# EAGLE board G80_a (EAGLE 8.2.2), part 1 of 2
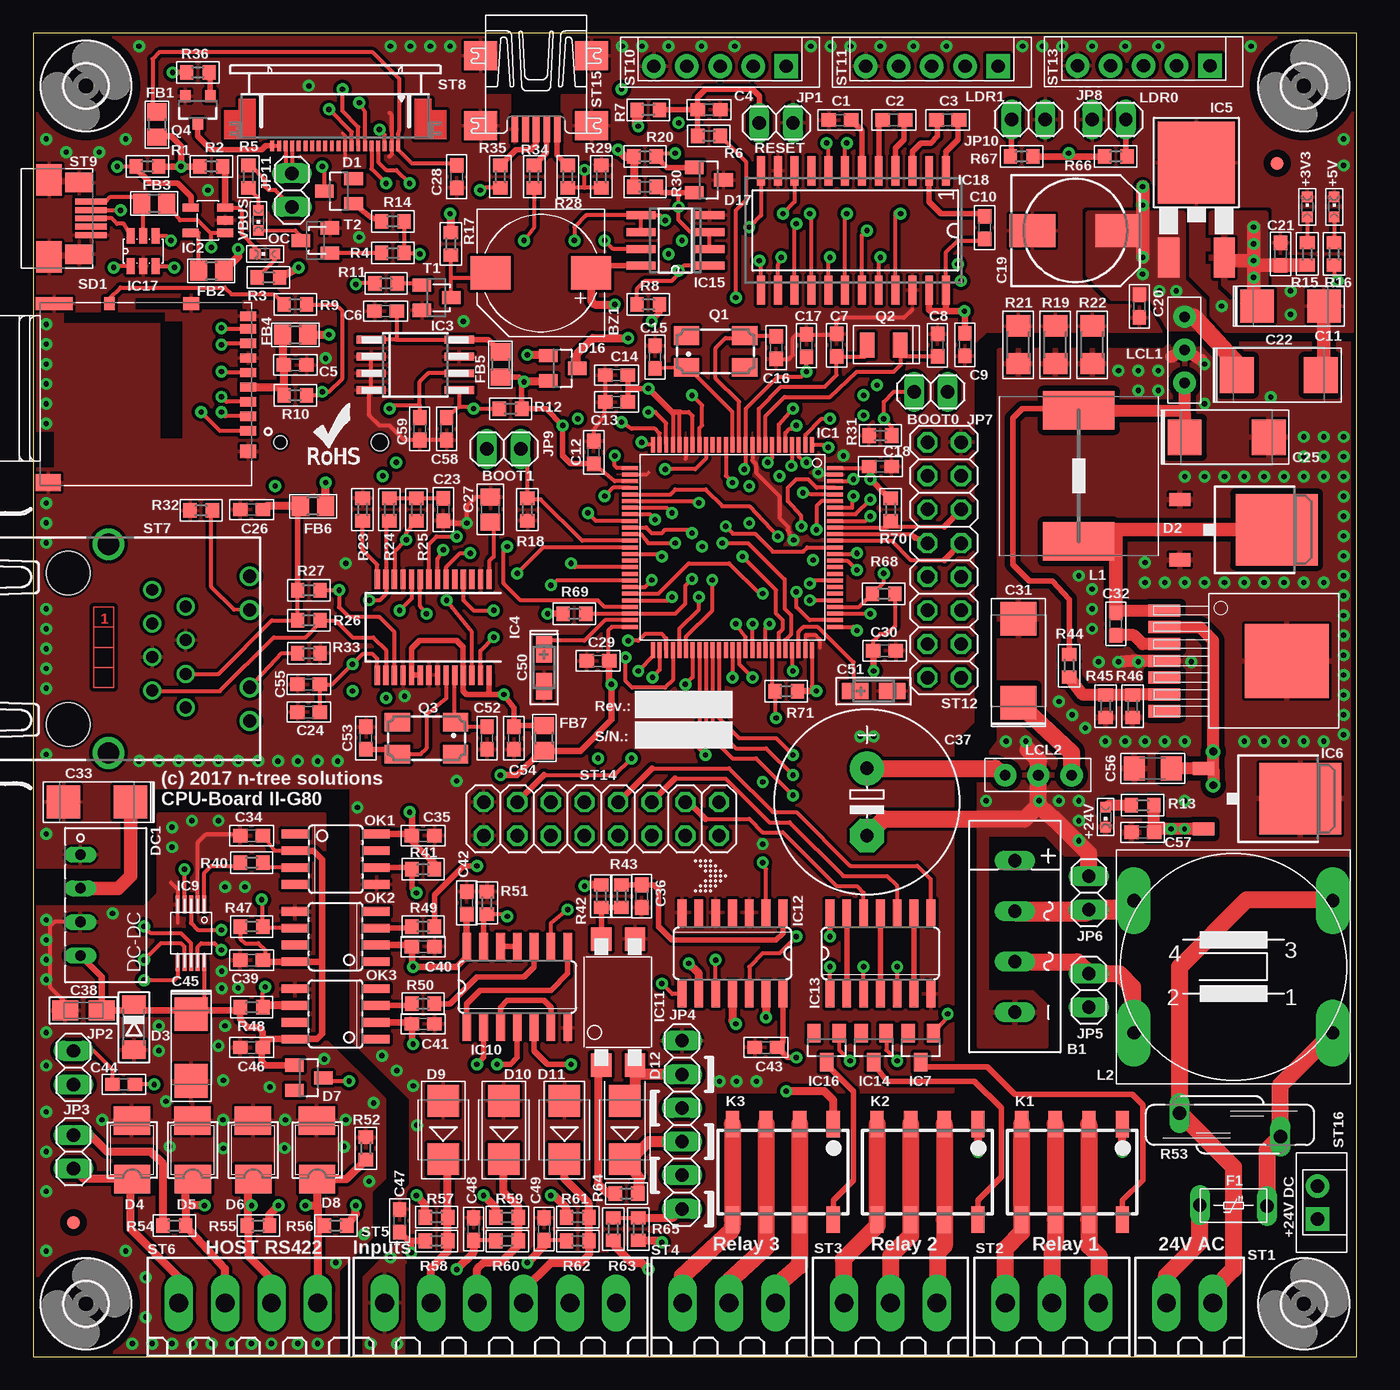
[diagram p10: board, top side]
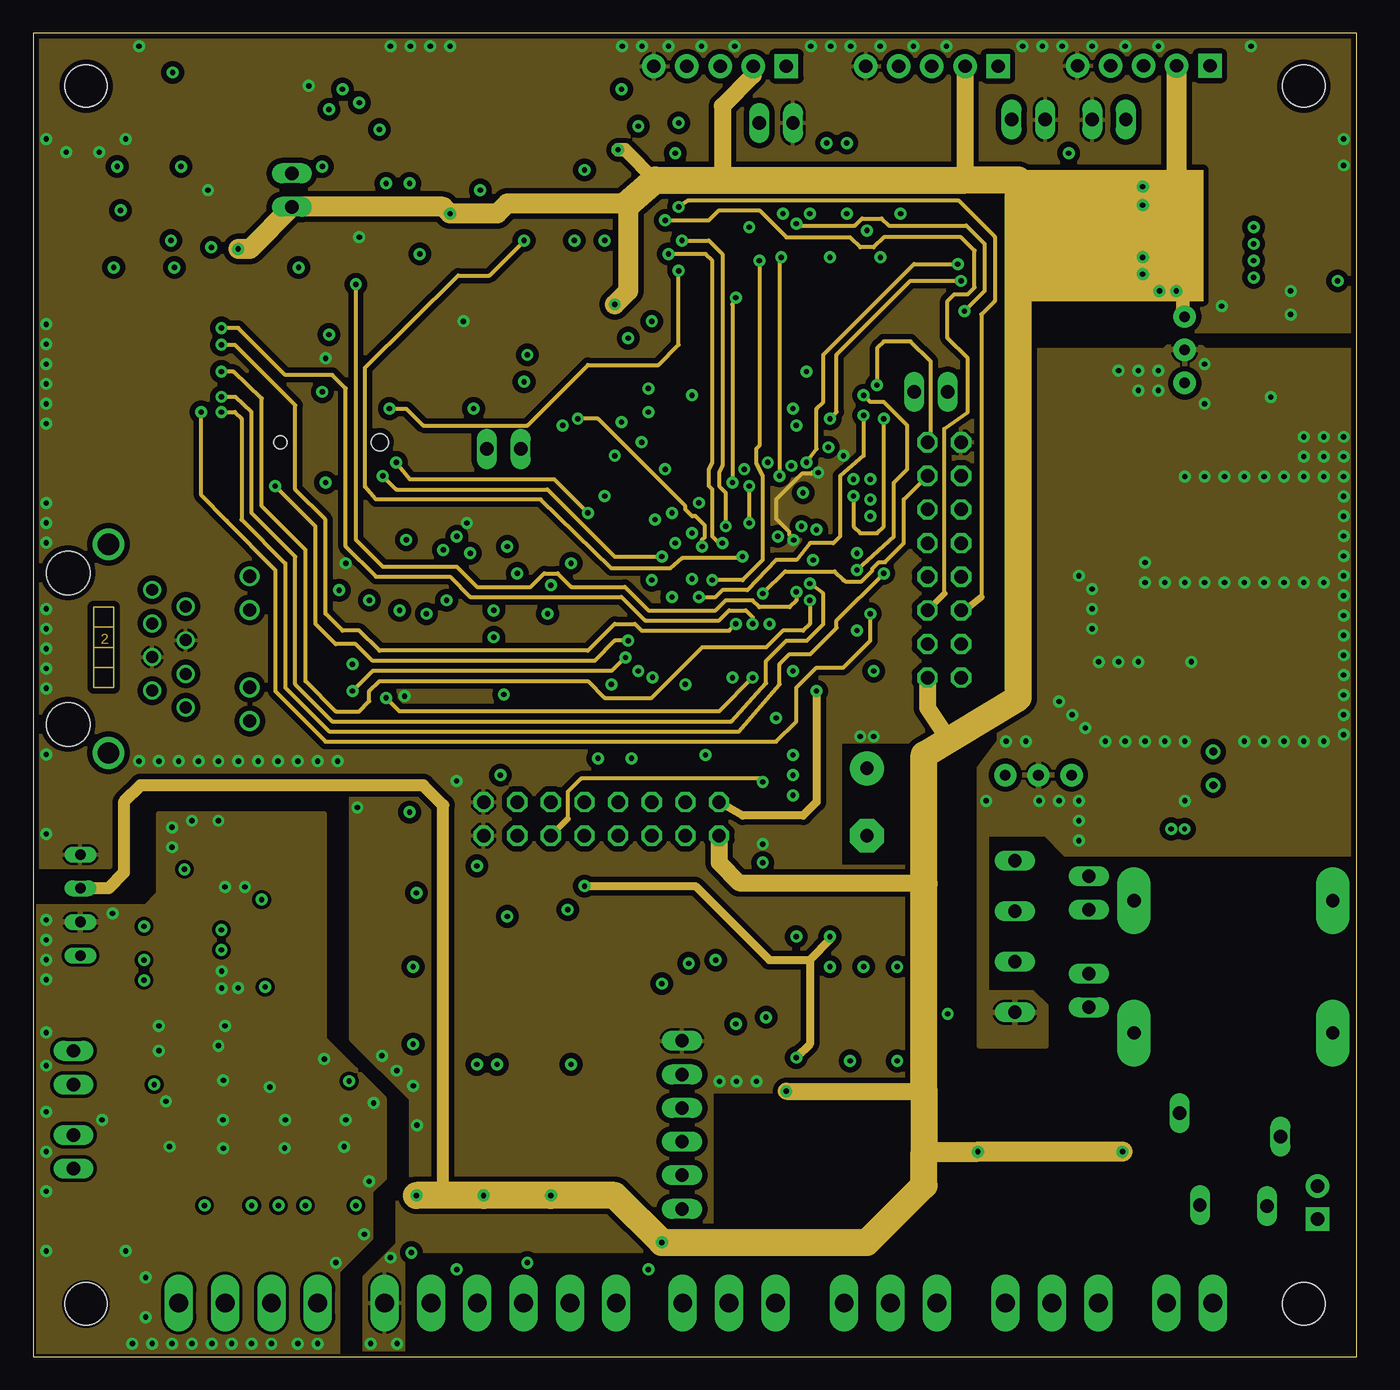
[diagram p11: board, inner layer IN1]
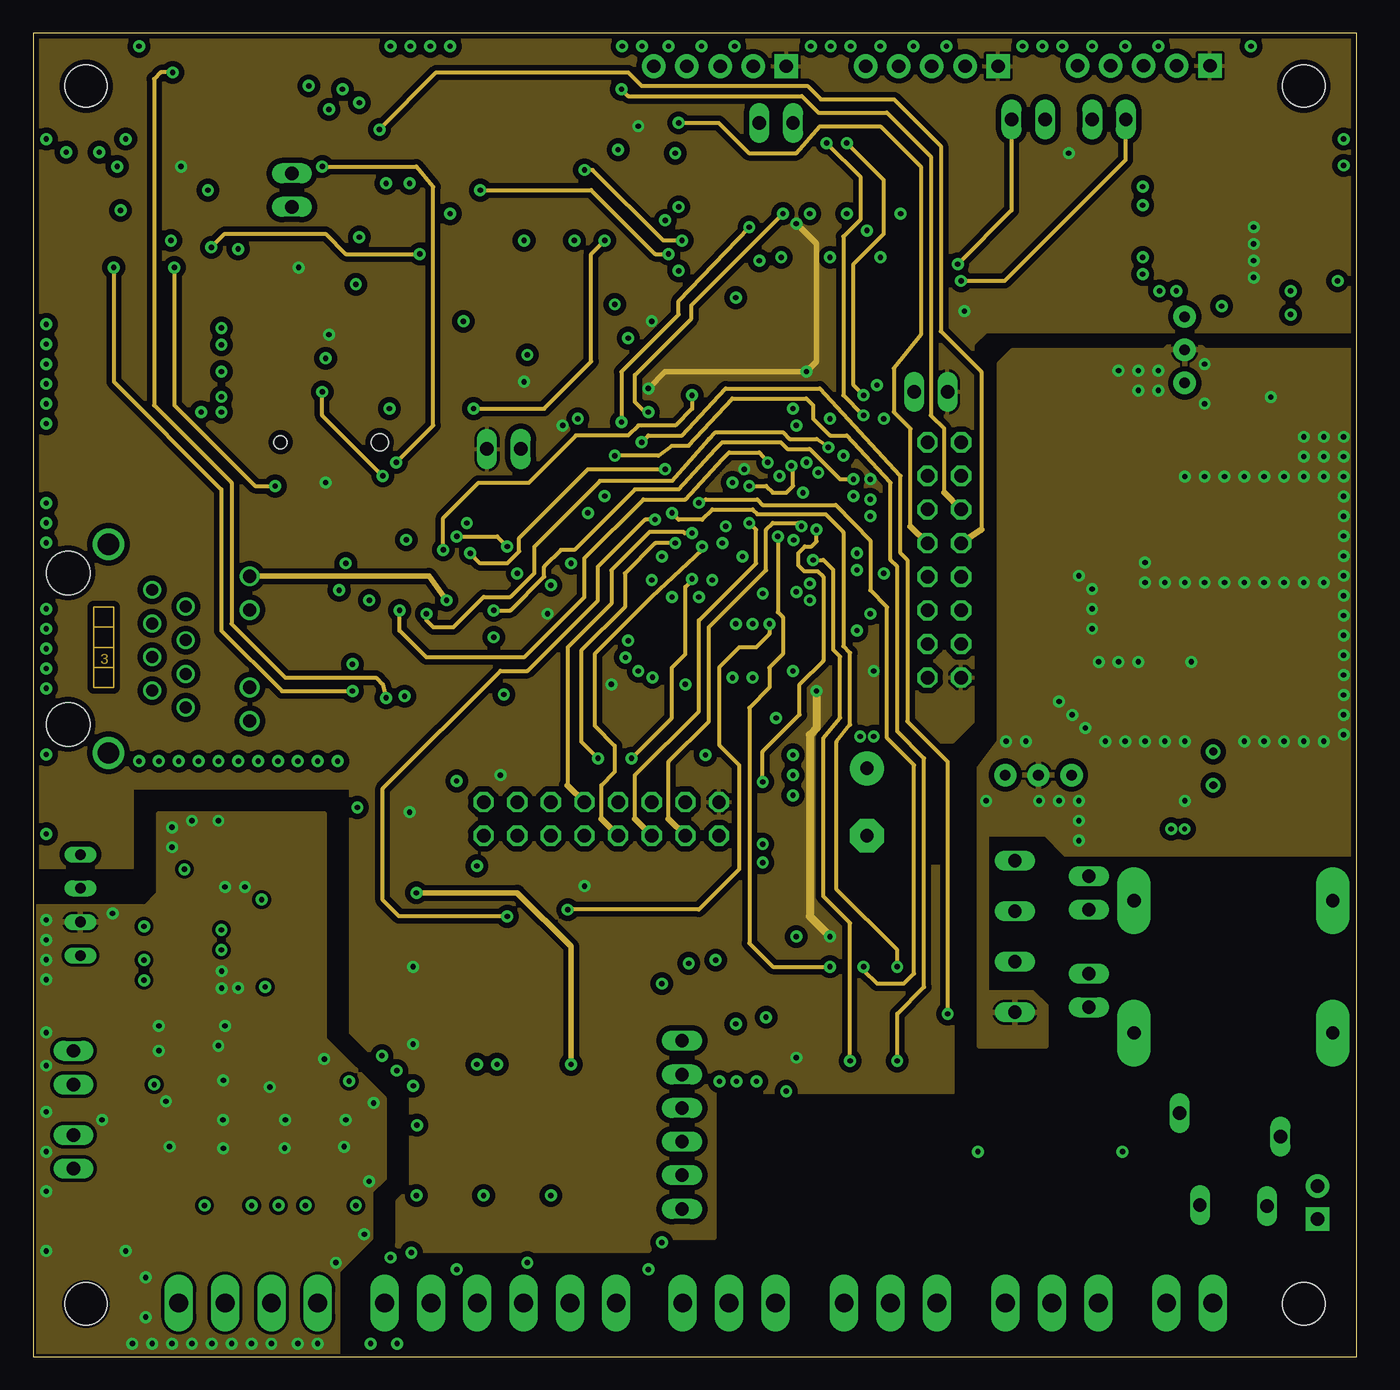
[diagram p12: board, inner layer +3V3]
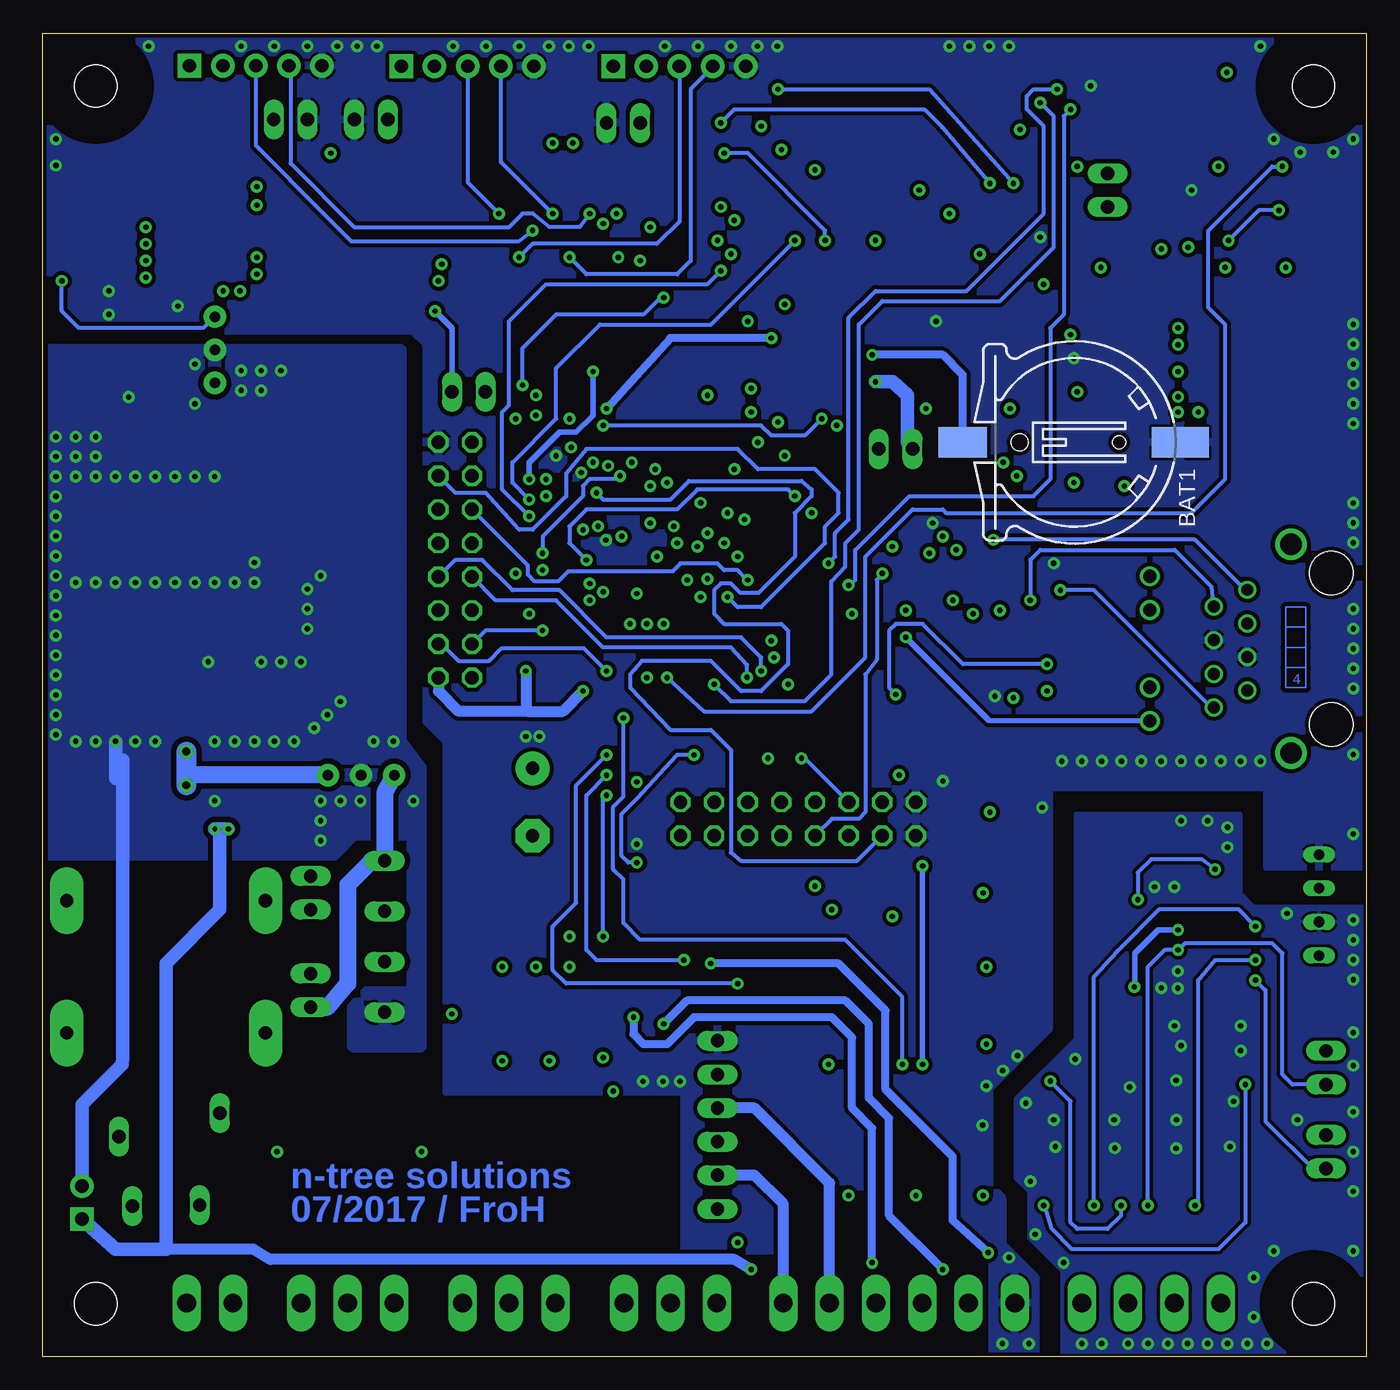
[diagram p13: board, bottom side, seen from below]

Size 100 x 100 mm. Coordinates in mm from the lower left corner, seen from the top.
Outline: 0,0 100,0 100,100 0,100 0,0
Copper layers ((1*2)+(15*16)): Top 0.018mm / dielectric 0.36mm / IN1 0.035mm / dielectric 0.71mm / +3V3 0.035mm / dielectric 0.2mm / Bottom 0.018mm
Design rules "Multi-CB_4L_125um-Tracks_OL35um-IL35um *": minimum track width 10mil, minimum drill 0.4mm, track to track 1mil, track to pad 1mil, pad to pad 1mil, via to via 1mil, smd to smd 0mil, copper to edge 0.2mm, drill to drill 0.2mm, minimum pad ring 0.125mm, minimum via ring 0.25mm, stop-mask expansion 2mil, vias tented up to drill 0.45mm, thermal gap 0.2mm
Net classes: 0 default: width 0.254 mm, drill 0.5 mm, clearance 0.254 mm; 1 0.5A: width 0.254 mm, drill 0.6 mm, clearance 0.254 mm; 2 24V AC Signal: width 1.524 mm, drill 0.6 mm, clearance 0.305 mm; 3 2A: width 1.016 mm, drill 0.6 mm, clearance 0.305 mm; 4 3A: width 1.524 mm, drill 0.6 mm, clearance 0.305 mm
bRestrict: area 103.1,69.3 to 110.5,79.5; area 103.6,61.5 to 111,68.1

## Footprints (pad centres in the part's own frame; a part is rotated, then mirrored left to right if it is on the bottom)
2KBP = drill 1.016 long: + 5.715,0; - -5.715,0; AC1 -1.905,0; AC2 1.905,0
CH291-1220LF = smd 2.3 x 3.66: + 0,-2.296 | smd 2.3 x 4.3: - 0,14.146 | hole 1.3: 0,2 | hole 1: 0,9.5
KTG0905CL = smd 2.5 x 3: P$1 0,3.8; P$2 0,-3.8
C0603 = smd 1.1 x 1: 1 -0.85,0; 2 0.85,0
C/6032-28R = smd 2.55 x 2.5: + 2.525,0; - -2.525,0
150CLZ-0810 = smd 3.5 x 2.5: + 3.25,0; - -3.25,0
D/7343-31R = smd 2.55 x 2.7: + 3.175,0; - -3.175,0
C0805 = smd 1.3 x 1.5: 1 -0.95,0; 2 0.95,0
E5-13 = drill 1.016 pad 2.54: + -2.54,0 | drill 1.016 pad 2.54 octagon: - 2.54,0
A/3216-18R = smd 1.95 x 1.5: + 1.375,0; - -1.375,0
CT3216 = smd 2 x 1.2: + -1.4,0; - 1.4,0
C1206 = smd 1.6 x 1.8: 1 -1.4,0; 2 1.4,0
SOT23 = smd 1 x 1.4: 1 -0.95,-1.1; 2 0.95,-1.1; 3 0,1.1
DPACK_3 = smd 1 x 1.6: 1 -2.28,-4.8; 3 2.28,-4.8 | smd 5.4 x 6.2: 4 0,2.5
SOD80C = smd 1.4 x 1.8: A 1.7,0; C -1.7,0
SMB = smd 2.159 x 2.743: 1 -2.311,-0.127; 2 2.108,-0.102
SMB' = smd 2.4 x 2.4: A 2.2,0; C -2.2,0
NME = drill 0.8 long: 1 0,3.81; 2 0,1.27; 3 0,-1.27; 4 0,-3.81
RXEF025-2 = drill 1 long: IN -2.54,0.04; OUT 2.54,-0.04
R805 = smd 1.3 x 1.5: 1 -0.95,0; 2 0.95,0
FIDUCIAL-1X2 = smd 1 x 1: 1 0,0
LQFP100 = smd 0.3 x 1.2: 1 -6,-7.75; 2 -5.5,-7.75; 3 -5,-7.75; 4 -4.5,-7.75; 5 -4,-7.75; 6 -3.5,-7.75; 7 -3,-7.75; 8 -2.5,-7.75; 9 -2,-7.75; 10 -1.5,-7.75; 11 -1,-7.75; 12 -0.5,-7.75; 13 0,-7.75; 14 0.5,-7.75; 15 1,-7.75; 16 1.5,-7.75; 17 2,-7.75; 18 2.5,-7.75; 19 3,-7.75; 20 3.5,-7.75; 21 4,-7.75; 22 4.5,-7.75; 23 5,-7.75; 24 5.5,-7.75; 25 6,-7.75; 51 6,7.75; 52 5.5,7.75; 53 5,7.75; 54 4.5,7.75; 55 4,7.75; 56 3.5,7.75; 57 3,7.75; 58 2.5,7.75; 59 2,7.75; 60 1.5,7.75; 61 1,7.75; 62 0.5,7.75; 63 0,7.75; 64 -0.5,7.75; 65 -1,7.75; 66 -1.5,7.75; 67 -2,7.75; 68 -2.5,7.75; 69 -3,7.75; 70 -3.5,7.75; 71 -4,7.75; 72 -4.5,7.75; 73 -5,7.75; 74 -5.5,7.75; 75 -6,7.75 | smd 1.2 x 0.3: 26 7.75,-6; 27 7.75,-5.5; 28 7.75,-5; 29 7.75,-4.5; 30 7.75,-4; 31 7.75,-3.5; 32 7.75,-3; 33 7.75,-2.5; 34 7.75,-2; 35 7.75,-1.5; 36 7.75,-1; 37 7.75,-0.5; 38 7.75,0; 39 7.75,0.5; 40 7.75,1; 41 7.75,1.5; 42 7.75,2; 43 7.75,2.5; 44 7.75,3; 45 7.75,3.5; 46 7.75,4; 47 7.75,4.5; 48 7.75,5; 49 7.75,5.5; 50 7.75,6; 76 -7.75,6; 77 -7.75,5.5; 78 -7.75,5; 79 -7.75,4.5; 80 -7.75,4; 81 -7.75,3.5; 82 -7.75,3; 83 -7.75,2.5; 84 -7.75,2; 85 -7.75,1.5; 86 -7.75,1; 87 -7.75,0.5; 88 -7.75,0; 89 -7.75,-0.5; 90 -7.75,-1; 91 -7.75,-1.5; 92 -7.75,-2; 93 -7.75,-2.5; 94 -7.75,-3; 95 -7.75,-3.5; 96 -7.75,-4; 97 -7.75,-4.5; 98 -7.75,-5; 99 -7.75,-5.5; 100 -7.75,-6
SOT23-5 = smd 0.62 x 1.22: 1 -0.95,-1.31; 2 0,-1.31; 3 0.95,-1.31; 4 0.95,1.31; 5 -0.95,1.31
SO-08M = smd 0.6 x 2.2: 1 -1.905,-3.33; 2 -0.635,-3.33; 3 0.635,-3.33; 4 1.905,-3.33; 5 1.905,3.33; 6 0.635,3.33; 7 -0.635,3.33; 8 -1.905,3.33
SSOP28 = smd 0.4 x 1.5: 1 -4.225,-3.625; 2 -3.575,-3.625; 3 -2.925,-3.625; 4 -2.275,-3.625; 5 -1.625,-3.625; 6 -0.975,-3.625; 7 -0.325,-3.625; 8 0.325,-3.625; 9 0.975,-3.625; 10 1.625,-3.625; 11 2.275,-3.625; 12 2.925,-3.625; 13 3.575,-3.625; 14 4.225,-3.625; 15 4.225,3.625; 16 3.575,3.625; 17 2.925,3.625; 18 2.275,3.625; 19 1.625,3.625; 20 0.975,3.625; 21 0.325,3.625; 22 -0.325,3.625; 23 -0.975,3.625; 24 -1.625,3.625; 25 -2.275,3.625; 26 -2.925,3.625; 27 -3.575,3.625; 28 -4.225,3.625
D-PAK = smd 6.2 x 5.8: 1 -3.1,0 | smd 3 x 1.6: 2 4.08,2.1; 3 4.08,-2.1
TO252 = smd 1 x 1.6: 1 -2.28,-4.8; 2 2.28,-4.8 | smd 5.4 x 6.2: 3 0,2.5
TO263-7 = smd 0.91 x 2.41: 1 -3.81,-8.255; 2 -2.54,-8.255; 3 -1.27,-8.255; 4 0,-8.255; 5 1.27,-8.255; 6 2.54,-8.255; 7 3.81,-8.255 | smd 5.59 x 6.35: 8 0,0.985
TI_SN65HVD3080E = smd 0.3 x 1.33: 1 -1,-2.175; 2 -0.5,-2.175; 3 0,-2.175; 4 0.5,-2.175; 5 1,-2.175; 6 1,2.175; 7 0.5,2.175; 8 0,2.175; 9 -0.5,2.175; 10 -1,2.175
SO14 = smd 0.66 x 2.032: 1 -3.81,-3.073; 2 -2.54,-3.073; 3 -1.27,-3.073; 4 0,-3.073; 5 1.27,-3.073; 6 2.54,-3.073; 7 3.81,-3.073; 8 3.81,3.073; 9 2.54,3.073; 10 1.27,3.073; 11 0,3.073; 12 -1.27,3.073; 13 -2.54,3.073; 14 -3.81,3.073
SO-6/4 = smd 1.524 x 1.778: 1 1.27,4.763; 2 -1.27,4.763; 3 -1.27,-4.763; 4 1.27,-4.763
SO08 = smd 0.6 x 2.2: 1 -1.905,-2.6; 2 -0.635,-2.6; 3 0.635,-2.6; 4 1.905,-2.6; 5 1.905,2.6; 6 0.635,2.6; 7 -0.635,2.6; 8 -1.905,2.6
SO23-6L = smd 0.6 x 1.2: 1 0,0; 2 0.95,0; 3 1.9,0; 4 1.9,2.3; 5 0.95,2.3; 6 0,2.3
SSOP24 = smd 0.6 x 2.2: 1 -6.985,-4.5; 2 -5.715,-4.5; 3 -4.445,-4.5; 4 -3.175,-4.5; 5 -1.905,-4.5; 6 -0.635,-4.5; 7 0.635,-4.5; 8 1.905,-4.5; 9 3.175,-4.5; 10 4.445,-4.5; 11 5.715,-4.5; 12 6.985,-4.5; 13 6.985,4.5; 14 5.715,4.5; 15 4.445,4.5; 16 3.175,4.5; 17 1.905,4.5; 18 0.635,4.5; 19 -0.635,4.5; 20 -1.905,4.5; 21 -3.175,4.5; 22 -4.445,4.5; 23 -5.715,4.5; 24 -6.985,4.5
1X02 = drill 1.016 long: 1 -1.27,0; 2 1.27,0
1X06 = drill 1.016 long: 1 -6.35,0; 2 -3.81,0; 3 -1.27,0; 4 1.27,0; 5 3.81,0; 6 6.35,0
G6K-2F = smd 1 x 2: 1 -3.81,-3.6; 2 -1.27,-3.6; 3 1.27,-3.6; 4 3.81,-3.6; 5 3.81,3.6; 6 1.27,3.6; 7 -1.27,3.6; 8 -3.81,3.6
WE-PD_L/XL/XXL = smd 2.9 x 5.4: 1 -4.95,0; 2 4.95,0
RN112 = drill 1 pad 2.54 long: 1 -7.506,4.999; 2 7.506,4.999; 3 -7.506,-4.999; 4 7.506,-4.999
T-FILTERSIL = drill 0.8 pad 1.676: 1 -2.502,0; 2 0,0; 3 2.502,0
CHIPLED_0603 = smd 0.8 x 0.8: A 0,-0.75; C 0,0.75
SOIC08 = smd 0.66 x 2.032: 1 -1.905,-3.073; 2 -0.635,-3.073; 3 0.635,-3.073; 4 1.905,-3.073; 5 1.905,3.073; 6 0.635,3.073; 7 -0.635,3.073; 8 -1.905,3.073
CTS406 = smd 1.9 x 1.4: 1 -2.2,-1.2; 2 2.2,-1.2; 3 2.2,1.2; 4 -2.2,1.2
3.2X1.5-2-PAD = smd 1.1 x 1.9: 1 -1.25,0; 2 1.25,0
SOT23-3 = smd 0.8 x 0.9: 1 -0.95,-1; 2 0.95,-1; 3 0,1.1
R0603 = smd 1 x 1.1: 1 -0.85,0; 2 0.85,0
R1206 = smd 1.6 x 1.803: 1 -1.422,0; 2 1.422,0
S10K17 = drill 1.016 long: 1 -0.889,-3.81; 2 0.889,3.81
HRS_DM3AT-SF-PEJM5 = smd 0.7 x 1.2: 1 3.2,0; 2 2.1,0; 3 1,0; 4 -0.1,0; 5 -1.2,0; 6 -2.3,0; 7 -3.4,0; 8 -4.5,0; SWB -5.45,0 | smd 1 x 1.2: P1 -6.4,-4.3; P4 4.75,0 | smd 1 x 2.8: P2 -6.4,-14.65 | smd 1.3 x 1.9: P3 7.1,-15.1 | smd 1 x 0.8: SWA -6.4,-10.5
180G-2 = drill 1.422 long: 1 -1.75,0; 2 1.75,0
180G-3 = drill 1.422 long: 1 -3.5,0; 2 0,0; 3 3.5,0
180G-6 = drill 1.422 long: 1 -8.75,0; 2 -5.25,0; 3 -1.75,0; 4 1.75,0; 5 5.25,0; 6 8.75,0
180G-4 = drill 1.422 long: 1 -5.25,0; 2 -1.75,0; 3 1.75,0; 4 5.25,0
J1 = drill 0.9 pad 1.3: 1 4.445,2.54; 2 3.175,0; 3 1.905,2.54; 4 0.635,0; 5 -0.635,2.54; 6 -1.905,0; 7 -3.175,2.54; 8 -4.445,0 | drill 1 pad 1.422: 9 5.465,7.37; 10 2.925,7.37; 11 -2.925,7.37; 12 -5.465,7.37 | drill 1.6 pad 2.184: M1 -7.875,-3.3; M2 7.875,-3.3 | hole 3.3: 5.715,-6.35; -5.715,-6.35
52745-2090 = smd 0.3 x 0.8: 1 -4.75,2.5; 2 -4.25,2.5; 3 -3.75,2.5; 4 -3.25,2.5; 5 -2.75,2.5; 6 -2.25,2.5; 7 -1.75,2.5; 8 -1.25,2.5; 9 -0.75,2.5; 10 -0.25,2.5; 11 0.25,2.5; 12 0.75,2.5; 13 1.25,2.5; 14 1.75,2.5; 15 2.25,2.5; 16 2.75,2.5; 17 3.25,2.5; 18 3.75,2.5; 19 4.25,2.5; 20 4.75,2.5
MOLEX_47346-0001 = smd 0.45 x 2.388: 1 -1.27,0.508; 2 -0.635,0.508; 3 0,0.508; 4 0.635,0.508; 5 1.27,0.508 | smd 1.475 x 2.1: M1 -2.718,-0.381; M2 2.718,-0.381 | smd 2.375 x 1.9: M3 -2.921,-2.667; M6 2.921,-2.667
JST-EH5 = drill 1.016 pad 1.778 square: 1 0,0 | drill 1.016 pad 1.778: 2 2.5,0; 3 5,0; 4 7.5,0; 5 10,0
2X08 = drill 1.016 octagon: 1 -8.89,-1.27; 2 -8.89,1.27; 3 -6.35,-1.27; 4 -6.35,1.27; 5 -3.81,-1.27; 6 -3.81,1.27; 7 -1.27,-1.27; 8 -1.27,1.27; 9 1.27,-1.27; 10 1.27,1.27; 11 3.81,-1.27; 12 3.81,1.27; 13 6.35,-1.27; 14 6.35,1.27; 15 8.89,-1.27; 16 8.89,1.27
UX60A-MB-5ST = smd 2 x 0.5: 1 2.25,1.6; 2 2.25,0.8; 3 2.25,0; 4 2.25,-0.8; 5 2.25,-1.6 | smd 2.2 x 2.5: M1 -3.3,-4.2; M2 -3.3,4.2; M3 2,4.2; M4 2,-4.2
JST-EH2 = drill 1.016 pad 1.778 square: 1 0,0 | drill 1.016 pad 1.778: 2 2.5,0
SOT23-BEC = smd 1 x 1.4: B -0.95,-1.1; C 0,1.1; E 0.95,-1.1
3,2 = hole 3.2: 0,0

## Placement (x,y rotation side)
B1  2KBP02M  [2KBP]  74.17,31.75 90 top
BAT1  CH291-1220LF  [CH291-1220LF]  28.19,69.09 270 bottom
BZ1  CMI-9655S-SMT  [KTG0905CL]  38.35,81.88 270 top
C1  100nF  [C0603]  60.96,93.43 180 top
C2  100nF  [C0603]  65.02,93.43 0 top
C3  100nF  [C0603]  69.09,93.43 0 top
C4  100nF  [C0603]  51.05,94.21 0 top
C5  100nF  [C0603]  19.81,74.93 0 top
C6  100nF  [C0603]  26.63,78.99 0 top
C7  12,5pF  [C0603]  60.71,76.42 90 top
C8  12,5pF  [C0603]  68.33,76.42 90 top
C9  100nF  [C0603]  70.4,76.45 270 top
C10  100nF  [C0603]  71.88,85.31 270 top
C11  10uF  [C/6032-28R]  95,79.38 180 top
C12  100nF  [C0603]  42.35,68.33 90 top
C13  100nF  [C0603]  44.07,72.14 180 top
C14  100nF  [C0603]  44.07,74.17 180 top
C15  18pF  [C0603]  46.99,75.53 90 top
C16  18pF  [C0603]  56.13,76.24 270 top
C17  100nF  [C0603]  58.42,76.39 90 top
C18  100nF  [C0603]  64.01,67.24 0 top
C19  220uF/35V  [150CLZ-0810]  78.74,85.08 0 top
C20  100nF  [C0603]  83.57,79.36 270 top
C21  100nF  [C0603]  94.23,83.31 90 top
C22  100uF/16V lowESR  [D/7343-31R]  94.11,74.17 180 top
C23  100nF  [C0603]  30.99,64.01 270 top
C24  100nF  [C0603]  20.83,48.7 180 top
C25  100uF/16V lowESR  [D/7343-31R]  90.17,69.47 180 top
C26  100nF  [C0603]  16.51,64.01 180 top
C27  10uF, GRM21BC81E106KE5L  [C0805]  34.54,64.01 90 top
C28  100nF  [C0603]  32,89.15 270 top
C29  100nF  [C0603]  42.67,52.58 180 top
C30  100nF  [C0603]  64.33,53.34 0 top
C31  4,7µF lowESR 50V  [D/7343-31R]  74.44,52.58 270 top
C32  10nF/100V  [C0603]  81.79,55.37 90 top
C33  10uF/16V  [C/6032-28R]  4.83,41.91 0 top
C34  100nF  [C0603]  16.51,39.37 180 top
C35  100nF  [C0603]  29.46,39.37 0 top
C36  100nF  [C0603]  45.97,34.8 270 top
C37  1000uF/50V  [E5-13]  62.99,41.91 270 top
C38  1uF/16V  [A/3216-18R]  3.81,26.16 0 top
C39  100nF  [C0603]  16.51,29.97 180 top
C40  100nF  [C0603]  29.46,30.99 0 top
C41  100nF  [C0603]  29.46,25.15 0 top
C42  100nF  [C0603]  32.77,34.29 90 top
C43  100nF  [C0603]  55.37,23.37 180 top
C44  10nF/50V  [C0603]  6.86,20.57 0 top
C45  10uF/16V  [C/6032-28R]  11.94,23.37 90 top
C46  100nF  [C0603]  16.51,23.37 180 top
C47  100nF  [C0603]  27.69,10.29 90 top
C48  100nF  [C0603]  33.27,9.65 90 top
C49  100nF  [C0603]  38.61,9.65 90 top
C50  2,2uF  [CT3216]  38.61,52.07 270 top
C51  2,2uF  [CT3216]  63.5,50.29 0 top
C52  18pF  [C0603]  34.29,46.74 270 top
C53  18pF  [C0603]  25.15,46.74 90 top
C54  100nF  [C0603]  36.32,46.74 270 top
C55  100nF  [C0603]  20.83,50.8 180 top
C56  0,33uF/100V  [C1206]  84.58,44.45 180 top
C57  100nF  [C0603]  83.82,39.62 180 top
C58  220pF  [C0603]  31.24,70.1 270 top
C59  220pF  [C0603]  29.21,70.1 270 top
D1  BAT54  [SOT23]  23.11,88.06 90 top
D2  MBRD650CT  [DPACK_3]  91.44,62.48 270 top
D3  BZV50C5V6  [SOD80C]  7.62,24.89 270 top
D4  SMB15A  [SMB]  7.37,15.75 90 top
D5  SMB15A  [SMB]  11.94,15.75 90 top
D6  SMB15A  [SMB]  16.51,15.75 90 top
D7  BAV99  [SOT23]  20.83,21.08 270 top
D8  SMB15A  [SMB]  21.34,15.75 90 top
D9  SMB6.8  [SMB']  30.99,17.14 90 top
D10  SMB6.8  [SMB']  35.56,17.14 90 top
D11  SMB6.8  [SMB']  40.13,17.14 90 top
D12  SMB27  [SMB']  44.7,17.14 90 top
D16  BAT54C  [SOT23]  40.01,74.68 270 top
D17  BAT54A  [SOT23]  51.05,88.9 270 top
DC1  TME0505S  [NME]  3.58,34.12 0 top
F1  2A  [RXEF025-2]  90.69,11.43 0 top
FB1  [R805]  9.36,93.09 270 top
FB2  [R805]  13.46,82.04 0 top
FB3  [R805]  9.14,87.12 180 top
FB4  [R805]  19.81,77.22 0 top
FB5  [R805]  35.31,74.97 270 top
FB6  [R805]  21.15,64.26 180 top
FB7  [R805]  38.61,46.74 90 top
FID1  FIDUCIAL1X2  [FIDUCIAL-1X2]  93.98,90.17 0 top
FID2  FIDUCIAL1X2  [FIDUCIAL-1X2]  3.05,10.16 0 top
IC1  STM32F107  [LQFP100]  52.83,61.15 180 top
IC2  TPS2041B  [SOT23-5]  13.21,85.85 90 top
IC3  24AA025E48  [SO-08M]  28.87,74.93 270 top
IC4  EN28J60SS  [SSOP28]  30.23,55.12 180 top
IC5  MC33269DT3.3  [D-PAK]  87.88,87.11 270 top
IC6  7824DT  [TO252]  93.22,42.16 270 top
IC7  NUD3105  [SOT23]  67.06,23.37 180 top
IC8  LM2267TJ-ADJ  [TO263-7]  93.73,52.58 270 top
IC9  TI_SN65HVD3080E  [TI_SN65HVD3080E]  11.94,32 180 top
IC10  74HC14D  [SO14]  36.58,27.94 0 top
IC11  SFH6186-3  [SO-6/4]  44.2,26.8 180 top
IC12  74HC14D  [SO14]  52.83,30.48 180 top
IC13  74HC14D  [SO14]  64.01,30.48 0 top
IC14  NUD3105  [SOT23]  63.5,23.37 180 top
IC15  P82B96TD,118  [SO08]  48.51,84.33 90 top
IC16  NUD3105  [SOT23]  59.94,23.37 180 top
IC17  USBLC6-2SC6  [SO23-6L]  7.37,82.38 0 top
IC18  MAX3387E  [SSOP24]  61.98,85.09 180 top
JP1  Reset  [1X02]  56.13,93.22 0 top
JP2  RS484Abschluss  [1X02]  3.05,21.84 270 top
JP3  RS484Abschluss  [1X02]  3.05,15.49 270 top
JP4  Rückmeldung  [1X06]  49.02,17.53 90 top
JP5  AC/DC  [1X02]  79.76,27.69 270 top
JP6  AC/DC  [1X02]  79.76,35.05 270 top
JP7  Boot0  [1X02]  67.82,72.9 180 top
JP8  LDR0  [1X02]  81.28,93.47 180 top
JP9  Boot1  [1X02]  35.56,68.58 0 top
JP10  LDR1  [1X02]  75.18,93.47 0 top
JP11  BLV  [1X02]  19.56,88.14 90 top
K1  G6K-2F  [G6K-2F]  78.49,13.97 180 top
K2  G6K-2F  [G6K-2F]  67.56,13.97 180 top
K3  G6K-2F  [G6K-2F]  56.64,13.97 180 top
L1  15µH 5A  [WE-PD_L/XL/XXL]  78.99,66.55 270 top
L2  RN112-02/02  [RN112]  90.68,29.46 180 top
LCL1  6A,10N  [T-FILTERSIL]  87,76.07 90 top
LCL2  6A,10N  [T-FILTERSIL]  75.95,43.94 0 top
LED1  OC\  [CHIPLED_0603]  17.53,83.31 90 top
LED2  VBUS  [CHIPLED_0603]  17.02,85.85 180 top
LED3  LED_+3V3  [CHIPLED_0603]  96.26,86.87 0 top
LED4  LED +5V  [CHIPLED_0603]  98.29,86.87 0 top
LED5  LED +24V  [CHIPLED_0603]  81.03,40.77 180 top
LOGO1  ROHS_LOGO  [ROHS_LOGO_0.18_IN]  20.57,67.31 0 top
OK1  HCPL0600  [SOIC08]  22.86,37.59 270 top
OK2  HCPL0600  [SOIC08]  22.86,31.75 90 top
OK3  HCPL0600  [SOIC08]  22.86,25.91 90 top
Q1  12MHz  [CTS406]  51.56,75.95 0 top
Q2  32.768kHz  [3.2X1.5-2-PAD]  64.26,76.42 180 top
Q3  25MHz  [CTS406]  29.72,46.74 180 top
Q4  NTR4003NT1G  [SOT23-3]  12.45,94.23 180 top
R1  10k  [R0603]  8.64,89.92 180 top
R2  47k  [R0603]  13.46,89.92 0 top
R3  4k7  [R0603]  17.78,81.53 180 top
R4  10k  [R0603]  27.18,83.38 0 top
R5  2k2  [R0603]  16.26,89.15 270 top
R6  100R  [R0603]  51.05,92.23 0 top
R7  100k  [R0603]  46.48,94.21 180 top
R8  1k  [R0603]  46.48,79.5 0 top
R9  330R  [R0603]  19.81,79.5 0 top
R10  10k  [R0603]  19.81,72.64 0 top
R11  10k  [R0603]  26.67,81.09 0 top
R12  1k  [R0603]  36.07,71.63 0 top
R13  470R  [R0603]  83.82,41.66 0 top
R14  100R  [R0603]  27.18,85.79 180 top
R15  220R  [R0603]  96.26,83.31 270 top
R16  470R  [R0603]  98.29,83.31 270 top
R17  10k  [R0603]  31.56,84.07 270 top
R18  10k  [R0603]  37.34,64.01 270 top
R19  0R  [R1206]  74.42,76.45 270 top
R20  330R  [R0603]  46.23,90.68 0 top
R21  0R  [R1206]  77.22,76.45 270 top
R22  0R  [R1206]  80.01,76.45 270 top
R23  2,32k  [R0603]  24.89,64.01 270 top
R24  49R9  [R0603]  26.92,64.01 270 top
R25  49R9  [R0603]  28.96,64.01 90 top
R26  49R9  [R0603]  20.83,55.63 180 top
R27  49R9  [R0603]  20.83,57.91 0 top
R28  10k  [R0603]  40.39,89.15 90 top
R29  10k  [R0603]  42.93,89.15 90 top
R30  330R  [R0603]  46.23,88.39 0 top
R31  10k  [R0603]  64.01,69.6 180 top
R32  270R  [R0603]  12.7,63.94 0 top
R33  270R  [R0603]  20.83,53.15 180 top
R34  33R  [R0603]  37.85,89.15 270 top
R35  33R  [R0603]  35.31,89.15 270 top
R36  100R  [R0603]  12.45,97.03 0 top
R40  470R  [R0603]  16.51,37.34 180 top
R41  1K5  [R0603]  29.46,36.83 0 top
R42  10k  [R0603]  42.93,34.8 90 top
R43  10k  [R0603]  44.45,34.8 270 top
R44  2k2  [R0603]  78.27,52.21 90 top
R45  10k  [R0603]  81.03,49.15 90 top
R46  820  [R0603]  83.06,49.15 90 top
R47  1K5  [R0603]  16.51,32.51 180 top
R48  1K5  [R0603]  16.51,26.42 180 top
R49  470R  [R0603]  29.46,32.51 180 top
R50  470R  [R0603]  29.46,26.67 180 top
R51  10k  [R0603]  34.29,34.29 270 top
R52  100R  [R0603]  25.15,15.75 270 top
R53  S10K30  [S10K17]  90.42,17.53 90 top
R54  100R  [R0603]  10.67,9.91 180 top
R55  100k  [R0603]  17.02,9.91 0 top
R56  100R  [R0603]  22.86,9.91 0 top
R57  10k  [R0603]  30.48,10.54 180 top
R58  10k  [R0603]  30.48,8.76 0 top
R59  10k  [R0603]  35.81,10.54 180 top
R60  10k  [R0603]  35.81,8.76 0 top
R61  10k  [R0603]  41.15,10.54 180 top
R62  10k  [R0603]  41.15,8.76 0 top
R63  0R  [R0603]  43.81,9.65 270 top
R64  1k2  [R0603]  44.83,12.32 0 top
R65  0R  [R0603]  45.72,9.65 90 top
R66  10k  [R0603]  81.79,90.68 0 top
R67  10k  [R0603]  74.68,90.68 180 top
R68  10k  [R0603]  64.26,57.66 180 top
R69  10k  [R0603]  40.89,56.13 0 top
R70  10k  [R0603]  64.77,64.01 270 top
R71  10k  [R0603]  56.9,50.29 180 top
SD1  DM3AT-SF-PEJM5  [HRS_DM3AT-SF-PEJM5]  16.26,73.15 270 top
ST1  Power  [180G-2]  87.38,4.06 0 top
ST2  RL1  [180G-3]  76.96,4.06 0 top
ST3  RL2  [180G-3]  64.77,4.06 0 top
ST4  RL3  [180G-3]  52.58,4.06 0 top
ST5  Inputs  [180G-6]  35.31,4.06 0 top
ST6  HOST  [180G-4]  16.26,4.06 0 top
ST7  J1011F01P  [J1]  9,53.5 270 top
ST8  52745-2090  [52745-2090]  22.82,93.98 180 top
ST9  47346-0001  [MOLEX_47346-0001]  3.87,86 270 top
ST10  COM3  [JST-EH5]  56.9,97.5 180 top
ST11  COM2  [JST-EH5]  72.9,97.5 180 top
ST12  Extern 1  [2X08]  68.83,60.2 90 top
ST13  COM4  [JST-EH5]  88.9,97.54 180 top
ST14  Extern 2  [2X08]  42.93,40.64 180 top
ST15  MINI-USB-SHIELD-UX60A-MB-5ST  [UX60A-MB-5ST]  38,95 270 top
ST16  Lüfter  [JST-EH2]  97.03,10.41 90 top
T1  BC846  [SOT23]  30.48,80.01 270 top
T2  BC846  [SOT23-BEC]  21.34,84.33 90 top
U$1  [3,2]  4,96 0 top
U$2  [3,2]  96,96 0 top
U$3  [3,2]  4,4 0 top
U$4  [3,2]  96,4 0 top